# Altium schematic sheet adc_chanels.b.SchDoc
size A4
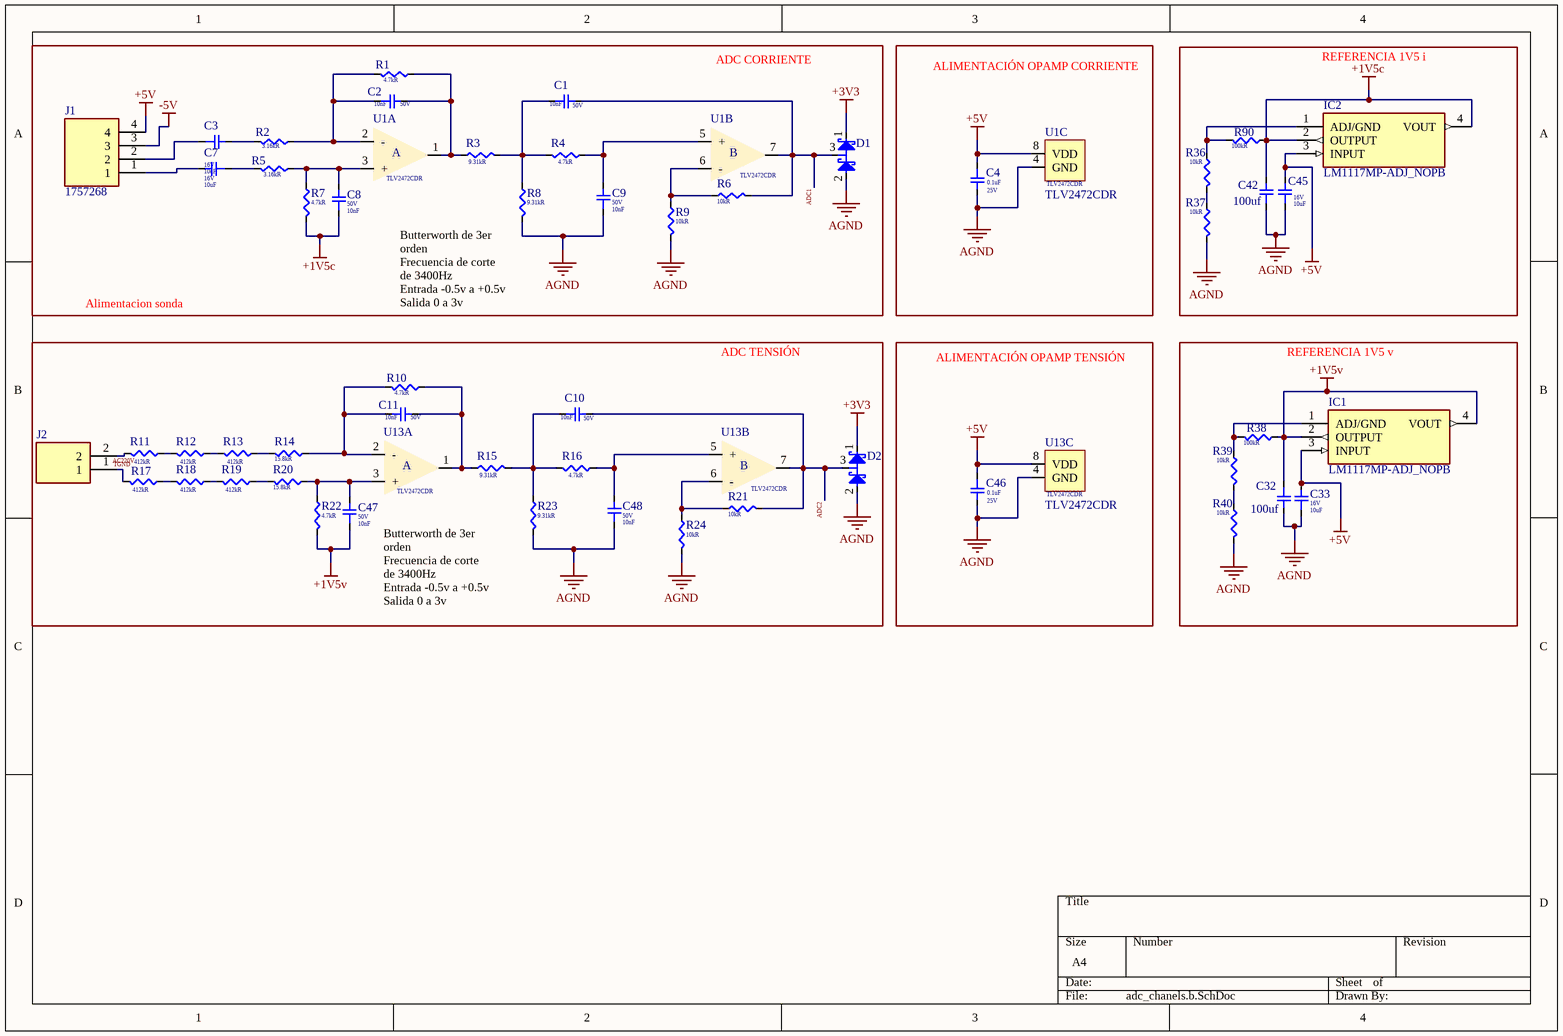
[diagram p0: adc_chanels.b.SchDoc]

## Parts
C1  Voltage: 50V  Capacitance: 10nF  [CAP smd 0805 ok]  (hidden comment: CAP_GRM2195C1H103FA01D_MURATA)
C2  Voltage: 50V  Capacitance: 10nF  [CAP smd 0805 ok]  (hidden comment: CAP_GRM2195C1H103FA01D_MURATA)
C3  Voltage Rating: 16V  Capacitance: 10uF  [CAP smd 0805 OK]  (hidden comment: CAP_CL21A106KOCL3RC)
C4  Voltage Rating: 25V  Capacitance: 0.1uF  [CAP smd 0805 ok]  (hidden comment: CAP_CC0805KRX7R8BB104_YAGEO)
C7  Voltage Rating: 16V  Capacitance: 10uF  [CAP smd 0805 OK]  (hidden comment: CAP_CL21A106KOCL3RC)
C8  Voltage: 50V  Capacitance: 10nF  [CAP smd 0805 ok]  (hidden comment: CAP_GRM2195C1H103FA01D_MURATA)
C9  Voltage: 50V  Capacitance: 10nF  [CAP smd 0805 ok]  (hidden comment: CAP_GRM2195C1H103FA01D_MURATA)
C10  Voltage: 50V  Capacitance: 10nF  [CAP smd 0805 ok]  (hidden comment: CAP_GRM2195C1H103FA01D_MURATA)
C11  Voltage: 50V  Capacitance: 10nF  [CAP smd 0805 ok]  (hidden comment: CAP_GRM2195C1H103FA01D_MURATA)
C32  100uf  [Cap 100uf]
C33  Voltage Rating: 16V  Capacitance: 10uF  [CAP smd 0805 OK]  (hidden comment: CAP_CL21A106KOCL3RC)
C42  100uf  [Cap 100uf]
C45  Voltage Rating: 16V  Capacitance: 10uF  [CAP smd 0805 OK]  (hidden comment: CAP_CL21A106KOCL3RC)
C46  Voltage Rating: 25V  Capacitance: 0.1uF  [CAP smd 0805 ok]  (hidden comment: CAP_CC0805KRX7R8BB104_YAGEO)
C47  Voltage: 50V  Capacitance: 10nF  [CAP smd 0805 ok]  (hidden comment: CAP_GRM2195C1H103FA01D_MURATA)
C48  Voltage: 50V  Capacitance: 10nF  [CAP smd 0805 ok]  (hidden comment: CAP_GRM2195C1H103FA01D_MURATA)
D1  BAS40-04-TP  [diode shockit ok]  (value not drawn)
D2  BAS40-04-TP  [diode shockit ok]  (value not drawn)
IC1  LM1117MP-ADJ_NOPB  [SOT230P700X180-4N]
IC2  LM1117MP-ADJ_NOPB  [SOT230P700X180-4N]
J1  1757268  [1757268]
J2  1757242  [1757242]  (value not drawn)
R1  Resistance: 4.7kR  [res 0805 ok]  (hidden comment: RC0805FR-074K7L)
R2  Resistance: 3.16kR  [res 0805 ok]  (hidden comment: RC0805FR-073K16L)
R3  Resistance: 9.31kR  [res 0805 ok]  (hidden comment: RC0805FR-079K31L)
R4  Resistance: 4.7kR  [res 0805 ok]  (hidden comment: RC0805FR-074K7L)
R5  Resistance: 3.16kR  [res 0805 ok]  (hidden comment: RC0805FR-073K16L)
R6  Resistance: 10kR  [res 0805 ok]  (hidden comment: RC0805FR-0710KL)
R7  Resistance: 4.7kR  [res 0805 ok]  (hidden comment: RC0805FR-074K7L)
R8  Resistance: 9.31kR  [res 0805 ok]  (hidden comment: RC0805FR-079K31L)
R9  Resistance: 10kR  [res 0805 ok]  (hidden comment: RC0805FR-0710KL)
R10  Resistance: 4.7kR  [res 0805 ok]  (hidden comment: RC0805FR-074K7L)
R11  Resistance: 412kR  [res 0805 ok]  (hidden comment: RC0805FR-07412KL)
R12  Resistance: 412kR  [res 0805 ok]  (hidden comment: RC0805FR-07412KL)
R13  Resistance: 412kR  [res 0805 ok]  (hidden comment: RC0805FR-07412KL)
R14  Resistance: 15.8kR  [res 0805 ok]  (hidden comment: RC0805FR-0715K8L)
R15  Resistance: 9.31kR  [res 0805 ok]  (hidden comment: RC0805FR-079K31L)
R16  Resistance: 4.7kR  [res 0805 ok]  (hidden comment: RC0805FR-074K7L)
R17  Resistance: 412kR  [res 0805 ok]  (hidden comment: RC0805FR-07412KL)
R18  Resistance: 412kR  [res 0805 ok]  (hidden comment: RC0805FR-07412KL)
R19  Resistance: 412kR  [res 0805 ok]  (hidden comment: RC0805FR-07412KL)
R20  Resistance: 15.8kR  [res 0805 ok]  (hidden comment: RC0805FR-0715K8L)
R21  Resistance: 10kR  [res 0805 ok]  (hidden comment: RC0805FR-0710KL)
R22  Resistance: 4.7kR  [res 0805 ok]  (hidden comment: RC0805FR-074K7L)
R23  Resistance: 9.31kR  [res 0805 ok]  (hidden comment: RC0805FR-079K31L)
R24  Resistance: 10kR  [res 0805 ok]  (hidden comment: RC0805FR-0710KL)
R36  Resistance: 10kR  [res 0805 ok]  (hidden comment: RC0805JR-0710KL)
R37  Resistance: 10kR  [res 0805 ok]  (hidden comment: RC0805JR-0710KL)
R38  Resistance: 100kR  [res 0805 ok]  (hidden comment: AC0805JR-07100KL)
R39  Resistance: 10kR  [res 0805 ok]  (hidden comment: RC0805JR-0710KL)
R40  Resistance: 10kR  [res 0805 ok]  (hidden comment: RC0805JR-0710KL)
R90  Resistance: 100kR  [res 0805 ok]  (hidden comment: AC0805JR-07100KL)
U1  TLV2472CDR  [tlv2472 ok]  (value not drawn)  (parts A,B,C of 3)
U13  TLV2472CDR  [tlv2472 ok]  (value not drawn)  (parts A,B,C of 3)

## Blocks framed on the sheet
ALIMENTACIÓN OPAMP CORRIENTE: C4 U1
REFERENCIA 1V5 i: C42 C45 IC2 R36 R37 R90
ADC TENSIÓN: C10 C11 C47 C48 D2 J2 R10-R24 U13
ALIMENTACIÓN OPAMP TENSIÓN: C46 U13
REFERENCIA 1V5 v: C32 C33 IC1 R38-R40

## Nets
+1V5c: C8.23 C42.23 IC2.2(OUTPUT) IC2.4(VOUT) R7.2 R90.1
+1V5v: C32.22 C47.23 IC1.2(OUTPUT) IC1.4(VOUT) R22.2 R38.1
+3V3: D1.1 D2.1
+5V: C4.23 C33.22 C45.22 C46.23 IC1.3(INPUT) IC2.3(INPUT) J1.4 U1.8(VDD) U13.8(VDD)
-5V: J1.3
AGND: C4.22 C9.23 C32.23 C33.23 C42.22 C45.23 C46.22 C48.23 D1.2 D2.2 R8.2 R9.2 R23.2 R24.2 R37.1 R40.1 U1.4(GND) U13.4(GND)
AC220V: J2.2 R11.2
ADC1: C1.22 D1.3 R6.2 U1.7
ADC2: C10.22 D2.3 R21.2 U13.7
TGND: J2.1 R17.2
NetC1_23: C1.23 R3.2 R4.2 R8.1
NetC2_22: C2.22 R1.1 R3.1 U1.1
NetC2_23: C2.23 R1.2 R2.2 U1.2(-)
NetC3_22: C3.22 R2.1
NetC3_23: C3.23 J1.2
NetC7_22: C7.22 J1.1
NetC7_23: C7.23 R5.1
NetC8_22: C8.22 R5.2 R7.1 U1.3(+)
NetC9_22: C9.22 R4.1 U1.5(+)
NetC10_23: C10.23 R15.2 R16.2 R23.1
NetC11_22: C11.22 R10.1 R15.1 U13.1
NetC11_23: C11.23 R10.2 R14.1 U13.2(-)
NetC47_22: C47.22 R20.1 R22.1 U13.3(+)
NetC48_22: C48.22 R16.1 U13.5(+)
NetIC1_1: IC1.1(ADJ/GND) R38.2 R39.2
NetIC2_1: IC2.1(ADJ/GND) R36.2 R90.2
NetR6_1: R6.1 R9.1 U1.6(-)
NetR11_1: R11.1 R12.2
NetR12_1: R12.1 R13.2
NetR13_1: R13.1 R14.2
NetR17_1: R17.1 R18.2
NetR18_1: R18.1 R19.2
NetR19_1: R19.1 R20.2
NetR21_1: R21.1 R24.1 U13.6(-)
NetR36_1: R36.1 R37.2
NetR39_1: R39.1 R40.2

## Notes on the sheet
- ADC CORRIENTE
- Alimentacion sonda
- (near R8) Butterworth de 3er orden
  Frecuencia de corte de 3400Hz
  Entrada -0.5v a +0.5v
  Salida 0 a 3v
- Butterworth de 3er orden
  Frecuencia de corte de 3400Hz
  Entrada -0.5v a +0.5v
  Salida 0 a 3v
- (in symbol TLV2472CDR, part A) A
- (in symbol TLV2472CDR, part B) B

## Library data of the parts
C1 C2 C8-C11 C47 C48 = CAP_GRM2195C1H103FA01D_MURATA: 0805 10 nF 50 V ±1% Tolerance C0G SMD Multilayer Ceramic Capacitor; Manufacturer 1: Murata; Temperature Coefficient: 30ppm/°C; Supplier 1: Arrow Electronics; Manufacturer Part Number 1: GRM2195C1H103FA01D; Stock 1: 3; Pricing 1: 1=0,54310 (USD); RoHS: Yes; Mount: Surface Mount; Case/Package: 0805; Case Code (Imperial): 0805; Case Code (Metric): 2012; Min Operating Temperature: -55°C; Max Operating Temperature: 125°C; Tolerance: 1%; Dielectric: C0G; Packaging: Tape and Reel; Voltage Rating: 50V; Voltage Rating (DC): 50V; Package Quantity: 4000; Termination: SMD/SMT; Series: GRM; Construction: Flat; Length: 2mm; Width: 1.25mm; Height: 0.85mm; Depth: 1.25mm; Thickness: 0.037inch; Radiation Hardening: No; REACH SVHC: No SVHC; Lead Free: Lead Free; RoHS Compliant: Yes; ComponentLink1URL: https://datasheet.ciiva.com/29542/partnumbering-e-01-29542571.pdf?src-supplier=Digi-Key; ComponentLink1Description: https://datasheet.ciiva.com/29542/partnumbering-e-01-29542571.pdf?src-supplier=Digi-Key; ComponentLink2URL: https://datasheet.ciiva.com/29542/partnumbering-e-01-29542569.pdf?src-supplier=Digi-Key; ComponentLink2Description: https://datasheet.ciiva.com/29542/partnumbering-e-01-29542569.pdf?src-supplier=Digi-Key; ComponentLink3URL: https://datasheet.ciiva.com/29542/partnumbering-e-01-29542570.pdf?src-supplier=Digi-Key; ComponentLink3Description: https://datasheet.ciiva.com/29542/partnumbering-e-01-29542570.pdf?src-supplier=Digi-Key; ComponentLink4URL: https://datasheet.ciiva.com/17452/c02e-17452856.pdf?src-supplier=Avnet+Europe; ComponentLink4Description: https://datasheet.ciiva.com/17452/c02e-17452856.pdf?src-supplier=Avnet+Europe; ComponentLink5URL: https://datasheet.ciiva.com/16497/c02e-16497047.pdf?src-supplier=Future+Electronics; ComponentLink5Description: https://datasheet.ciiva.com/16497/c02e-16497047.pdf?src-supplier=Future+Electronics; Supplier Part Number 1: GRM2195C1H103FA01D
C3 C7 C33 C45 = CAP_CL21A106KOCL3RC: CAP CER 10UF 16V X5R 0805; Manufacturer 1: Samsung; Tolerance: 10%; Supplier 1: Digi-Key; Manufacturer Part Number 1: CL21A106KOCL3RC; Stock 1: 0; RoHS: Yes; Mount: Surface Mount; Case/Package: 0805; Case Code (Metric): 2012; Case Code (Imperial): 0805; Min Operating Temperature: -55°C; Max Operating Temperature: 85°C; Package Quantity: 1; Packaging: Tape and Reel; Series: CL; Length: 0.079inch; Width: 0.049inch; Thickness: 0.037inch; RoHS Compliant: Yes; ComponentLink1URL: https://datasheet.ciiva.com/25796/cl21a106kocl3rc-25796224.pdf?src-supplier=Digi-Key; ComponentLink1Description: https://datasheet.ciiva.com/25796/cl21a106kocl3rc-25796224.pdf?src-supplier=Digi-Key; Supplier Part Number 1: 1276-2398-2-ND
C4 C46 = CAP_CC0805KRX7R8BB104_YAGEO: CAPACITOR, 0805, 100NF, 25V, REEL 4000; Manufacturer 1: Yageo; Material: Ceramic; Tolerance: 10%; Dielectric: X7R; Insulation Resistance: 100GR; Supplier 1: Digi-Key; Manufacturer Part Number 1: CC0805KRX7R8BB104; Stock 1: 278639; Pricing 1: 1=0,12000, 10=0,08800, 50=0,04980, 100=0,04130, 500=0,02894, 1000=0,02396 (USD); RoHS: Yes; Mount: Surface Mount; Case/Package: 0805; Number of Pins: 2; Case Code (Metric): 2012; Case Code (Imperial): 0805; Min Operating Temperature: -55°C; Max Operating Temperature: 125°C; Package Quantity: 1; Packaging: Tape and Reel; Voltage Rating (DC): 25V; Termination: SMD/SMT; Resistor Type: Ceramic; Series: CC; Length: 2mm; Width: 0.049inch; Height: 0.85mm; Thickness: 0.033inch; Depth: 1.25mm; Radiation Hardening: No; REACH SVHC: No SVHC; Lead Free: Lead Free; Halogen Free: Halogen Free; RoHS Compliant: Yes; ComponentLink1URL: https://datasheet.ciiva.com/8034/70765-8034031.pdf?src-supplier=Element14; ComponentLink1Description: https://datasheet.ciiva.com/8034/70765-8034031.pdf?src-supplier=Element14; ComponentLink2URL: https://datasheet.ciiva.com/28450/1489800-28450789.pdf?src-supplier=Element14; ComponentLink2Description: https://datasheet.ciiva.com/28450/1489800-28450789.pdf?src-supplier=Element14; ComponentLink3URL: https://datasheet.ciiva.com/46430/1850775-46430166.pdf?src-supplier=Element14; ComponentLink3Description: https://datasheet.ciiva.com/46430/1850775-46430166.pdf?src-supplier=Element14; ComponentLink4URL: https://datasheet.ciiva.com/145/mlccorderingcode-145008.pdf?src-supplier=Digi-Key; ComponentLink4Description: https://datasheet.ciiva.com/145/mlccorderingcode-145008.pdf?src-supplier=Digi-Key; ComponentLink5URL: https://datasheet.ciiva.com/145/mlccorderingcode-145007.pdf?src-supplier=Digi-Key; ComponentLink5Description: https://datasheet.ciiva.com/145/mlccorderingcode-145007.pdf?src-supplier=Digi-Key; ComponentLink6URL: https://datasheet.ciiva.com/145/mlccorderingcode-145009.pdf?src-supplier=Digi-Key; ComponentLink6Description: https://datasheet.ciiva.com/145/mlccorderingcode-145009.pdf?src-supplier=Digi-Key; ComponentLink7URL: https://datasheet.ciiva.com/8034/1784427-8034030.pdf?src-supplier=Element14; ComponentLink7Description: https://datasheet.ciiva.com/8034/1784427-8034030.pdf?src-supplier=Element14; ComponentLink8URL: https://datasheet.ciiva.com/8034/1784427-8034029.pdf?src-supplier=Element14; ComponentLink8Description: https://datasheet.ciiva.com/8034/1784427-8034029.pdf?src-supplier=Element14; ComponentLink9URL: https://datasheet.ciiva.com/15189/getdatasheetpartid-330244-15189223.pdf?src-supplier=Verical; ComponentLink9Description: https://datasheet.ciiva.com/15189/getdatasheetpartid-330244-15189223.pdf?src-supplier=Verical; ComponentLink10URL: https://datasheet.ciiva.com/16625/upy-gphc-x7r-6-3v-to-50v-8-16625546.pdf?src-supplier=Avnet+Europe; ComponentLink10Description: https://datasheet.ciiva.com/16625/upy-gphc-x7r-6-3v-to-50v-8-16625546.pdf?src-supplier=Avnet+Europe; Supplier Part Number 1: 311-1141-1-ND
C32 C42 = CAP 100uf murata
D1 D2 = BAS40-04-TP: DIODE ARRAY SCHOTTKY 40V SOT23; Manufacturer 1: MCC; Max Surge Current: 600mA; Recovery Time: 5ns; Forward Current: 200mA; Forward Voltage: 1V; Max Reverse Leakage Current: 200nA; Power Dissipation: 200mW; Element Configuration: Single; Capacitance: 5pF; Supplier 1: Digi-Key; Manufacturer Part Number 1: BAS40-04-TP; Stock 1: 0; Pricing 1: 1=0,26000, 10=0,21300, 100=0,11290, 500=0,07424, 1000=0,05049 (USD); RoHS: Yes; Mount: Surface Mount; Case/Package: SOT-23; Number of Pins: 3; Min Operating Temperature: -55°C; Max Operating Temperature: 125°C; Package Quantity: 3000; Packaging: Tape and Reel; Average Rectified Current: 200mA; Reverse Recovery Time: 5ns; Max Forward Surge Current (Ifsm): 600mA; Max Reverse Current: 200nA; Max Repetitive Reverse Voltage (Vrrm): 40V; Peak Non-Repetitive Surge Current: 600mA; Max Reverse Voltage (DC): 40V; Series: -; Length: 3.04mm; Width: 1.4mm; Height: 1.02mm; Radiation Hardening: No; REACH SVHC: Unknown; Lead Free: Lead Free; RoHS Compliant: Yes; ComponentLink1URL: https://datasheet.ciiva.com/4716/bas40-bas70sot-23-28891-4716000.pdf?src-supplier=Mouser; ComponentLink1Description: https://datasheet.ciiva.com/4716/bas40-bas70sot-23-28891-4716000.pdf?src-supplier=Mouser; ComponentLink2URL: https://datasheet.ciiva.com/23684/1684803-23684306.pdf?src-supplier=Newark; ComponentLink2Description: https://datasheet.ciiva.com/23684/1684803-23684306.pdf?src-supplier=Newark; ComponentLink3URL: https://datasheet.ciiva.com/906/bas40-bas70sot-23-906318.pdf?src-supplier=Digi-Key; ComponentLink3Description: https://datasheet.ciiva.com/906/bas40-bas70sot-23-906318.pdf?src-supplier=Digi-Key; ComponentLink4URL: https://datasheet.ciiva.com/906/bas40-bas70sot-23-906319.pdf?src-supplier=Digi-Key; ComponentLink4Description: https://datasheet.ciiva.com/906/bas40-bas70sot-23-906319.pdf?src-supplier=Digi-Key; ComponentLink5URL: https://datasheet.ciiva.com/906/bas40-bas70sot-23-906320.pdf?src-supplier=Digi-Key; ComponentLink5Description: https://datasheet.ciiva.com/906/bas40-bas70sot-23-906320.pdf?src-supplier=Digi-Key; ComponentLink6URL: https://datasheet.ciiva.com/7624/1684803-7624699.pdf?src-supplier=Element14; ComponentLink6Description: https://datasheet.ciiva.com/7624/1684803-7624699.pdf?src-supplier=Element14; ComponentLink7URL: https://datasheet.ciiva.com/15200/getdatasheetpartid-226544-15200426.pdf?src-supplier=Verical; ComponentLink7Description: https://datasheet.ciiva.com/15200/getdatasheetpartid-226544-15200426.pdf?src-supplier=Verical; Supplier Part Number 1: BAS40-04TPMSDKR-ND
IC1 IC2 = LM1117MP-ADJ_NOPB: Integrated Circuit; Manufacturer_Name: Texas Instruments; Manufacturer_Part_Number: LM1117MP-ADJ/NOPB; Datasheet Link: https://datasheet.datasheetarchive.com/originals/distributors/Datasheets-SFU2/DSASFU100036103.pdf; Height: 1.8mm; Mouser Part Number: 926-LM1117MP-ADJNOPB; Mouser Price/Stock: https://www.mouser.co.uk/ProductDetail/Texas-Instruments/LM1117MP-ADJ-NOPB?qs=X1J7HmVL2ZHIFGWbJS5wtA%3D%3D; Arrow Part Number: LM1117MP-ADJ/NOPB; Arrow Price/Stock: https://www.arrow.com/en/products/lm1117mp-adjnopb/texas-instruments
J1 = 1757268: Connector; Manufacturer_Name: Phoenix Contact; Datasheet Link: http://www.phoenixcontact.com/de/produkte/1757268/pdf; Height: 8.72mm; Manufacturer_Part_Number: 1757268; Mouser Part Number: 651-1757268; Mouser Price/Stock: https://www.mouser.co.uk/ProductDetail/Phoenix-Contact/1757268?qs=uD%2FdkN7XIa2BicmSj3mD7g%3D%3D; Arrow Part Number: 1757268; Arrow Price/Stock: https://www.arrow.com/en/products/1757268/phoenix-contact?region=nac
J2 = 1757242: Connector; Manufacturer_Name: Phoenix Contact; Datasheet Link: http://www.phoenixcontact.com/de/produkte/1757242/pdf; Height: 8.72mm; Manufacturer_Part_Number: 1757242; Mouser Part Number: 651-1757242; Mouser Price/Stock: https://www.mouser.co.uk/ProductDetail/Phoenix-Contact/1757242?qs=uD%2FdkN7XIa3Ejiz9qDxlzw%3D%3D; Arrow Part Number: 1757242; Arrow Price/Stock: https://www.arrow.com/en/products/1757242/phoenix-contact?region=nac
R1 R4 R7 R10 R16 R22 = RC0805FR-074K7L: YAGEO - RC0805FR-074K7L - SMD  0805 [2012 Metric], 4.7 kohm,  125 mW; Tolerance: 1%; Temperature Coefficient: 100ppm/°C; Voltage Rating (DC): 150V; Power Rating: 125mW; Supplier 1: RSComponents; Manufacturer 1: Yageo; Manufacturer Part Number 1: RC0805FR-074K7L; Stock 1: 55000; Pricing 1: 5000=0,00500 (GBP); RoHS: Yes; Case/Package: 0805; Number of Pins: 2; Case Code (Metric): 2012; Case Code (Imperial): 0805; Size Code: 0805; Min Operating Temperature: -55°C; Max Operating Temperature: 155°C; Resistor Type: Thick Film; Packaging: Tape and Reel; Package Quantity: 5000; Voltage Rating: 150V; Number of Terminations: 2; Termination: SMD/SMT; Max Power Dissipation: 125mW; Features: Moisture Resistant; Series: RC; Resistance Tolerance: 1%; Technology: THICK FILM; Construction: Rectangular; Length: 0.079inch; Width: 0.049inch; Height: 0.024inch; Depth: 1.25mm; REACH SVHC: No SVHC; Lead Free: Lead Free; RoHS Compliant: Yes; Military Standard: Not; ComponentLink1URL: https://datasheet.ciiva.com/11808/0900766b8106beab-11808155.pdf?src-supplier=RSComponents; ComponentLink1Description: https://datasheet.ciiva.com/11808/0900766b8106beab-11808155.pdf?src-supplier=RSComponents; ComponentLink2URL: https://datasheet.ciiva.com/6547/pyu-r-int-thick-7-6547263.pdf?src-supplier=Digi-Key; ComponentLink2Description: https://datasheet.ciiva.com/6547/pyu-r-int-thick-7-6547263.pdf?src-supplier=Digi-Key; ComponentLink3URL: https://datasheet.ciiva.com/7941/444164-7941806.pdf?src-supplier=Element14; ComponentLink3Description: https://datasheet.ciiva.com/7941/444164-7941806.pdf?src-supplier=Element14; ComponentLink4URL: https://datasheet.ciiva.com/46447/444164-46447583.pdf?src-supplier=Element14; ComponentLink4Description: https://datasheet.ciiva.com/46447/444164-46447583.pdf?src-supplier=Element14; ComponentLink5URL: https://datasheet.ciiva.com/7941/444164-7941804.pdf?src-supplier=Element14; ComponentLink5Description: https://datasheet.ciiva.com/7941/444164-7941804.pdf?src-supplier=Element14; ComponentLink6URL: https://datasheet.ciiva.com/7941/1686128-7941805.pdf?src-supplier=Element14; ComponentLink6Description: https://datasheet.ciiva.com/7941/1686128-7941805.pdf?src-supplier=Element14; Supplier Part Number 1: 6181408
R2 R5 = RC0805FR-073K16L: Res Thick Film smd 0805 3.16K Ohm 1% 0.125W(1/8W); Manufacturer 1: Yageo; Power Rating: 125mW; Voltage Rating: 150V; Temperature Coefficient: 100ppm/°C; Supplier 1: Digi-Key; Manufacturer Part Number 1: RC0805FR-073K16L; Stock 1: 24399; Pricing 1: 1=0,10000, 10=0,04200, 100=0,01690, 1000=0,00759, 2500=0,00659 (USD); RoHS: Yes; Case/Package: 0805; Case Code (Metric): 2012; Case Code (Imperial): 0805; Weight: 0.000194oz; Size Code: 0805; Min Operating Temperature: -55°C; Max Operating Temperature: 155°C; Tolerance: 1%; Package Quantity: 1; Packaging: Tape and Reel; Resistor Type: Thick Film; Number of Terminations: 2; Termination: SMD/SMT; Max Power Dissipation: 125mW; Voltage Rating (DC): 150V; Features: Moisture Resistant; Series: RC; Construction: Rectangular; Length: 2mm; Width: 0.049inch; Height: 0.024inch; Depth: 1.25mm; Military Standard: Not; Lead Free: Lead Free; RoHS Compliant: Yes; ComponentLink1URL: https://datasheet.ciiva.com/2457/pyu-r-int-thick-7-2457284.pdf?src-supplier=Digi-Key; ComponentLink1Description: https://datasheet.ciiva.com/2457/pyu-r-int-thick-7-2457284.pdf?src-supplier=Digi-Key; ComponentLink2URL: https://datasheet.ciiva.com/2457/pyu-r-int-thick-7-2457285.pdf?src-supplier=Digi-Key; ComponentLink2Description: https://datasheet.ciiva.com/2457/pyu-r-int-thick-7-2457285.pdf?src-supplier=Digi-Key; ComponentLink3URL: https://datasheet.ciiva.com/2457/pyu-r-int-thick-7-2457286.pdf?src-supplier=Digi-Key; ComponentLink3Description: https://datasheet.ciiva.com/2457/pyu-r-int-thick-7-2457286.pdf?src-supplier=Digi-Key; ComponentLink4URL: https://datasheet.ciiva.com/12577/rc0805-12577436.pdf?src-supplier=Mouser; ComponentLink4Description: https://datasheet.ciiva.com/12577/rc0805-12577436.pdf?src-supplier=Mouser; Supplier Part Number 1: 311-3.16KCRCT-ND
R3 R8 R15 R23 = RC0805FR-079K31L: Res Thick Film smd 0805 9.31K Ohm 1% 0.125W(1/8W); Manufacturer 1: Yageo; Temperature Coefficient: 100ppm/°C; Power Rating: 125mW; Voltage Rating: 150V; Supplier 1: Digi-Key; Manufacturer Part Number 1: RC0805FR-079K31L; Stock 1: 10181; Pricing 1: 1=0,10000, 10=0,04200, 100=0,01690, 1000=0,00759, 2500=0,00659 (USD); RoHS: Yes; Case/Package: 0805; Contact Plating: Tin,Lead,Matte; Case Code (Imperial): 0805; Case Code (Metric): 2012; Size Code: 0805; Min Operating Temperature: -55°C; Max Operating Temperature: 155°C; Tolerance: 1%; Resistor Type: Thick Film; Packaging: Tape and Reel; Package Quantity: 1; Termination: SMD/SMT; Number of Terminations: 2; Max Power Dissipation: 125mW; Voltage Rating (DC): 150V; Features: Moisture Resistant; Series: RC; Construction: Rectangular; Length: 2mm; Width: 1.25mm; Height: 0.024inch; Depth: 1.25mm; Radiation Hardening: No; Military Standard: Not; Lead Free: Lead Free; RoHS Compliant: Yes; ComponentLink1URL: https://datasheet.ciiva.com/2457/pyu-r-int-thick-7-2457635.pdf?src-supplier=Digi-Key; ComponentLink1Description: https://datasheet.ciiva.com/2457/pyu-r-int-thick-7-2457635.pdf?src-supplier=Digi-Key; ComponentLink2URL: https://datasheet.ciiva.com/2457/pyu-r-int-thick-7-2457636.pdf?src-supplier=Digi-Key; ComponentLink2Description: https://datasheet.ciiva.com/2457/pyu-r-int-thick-7-2457636.pdf?src-supplier=Digi-Key; ComponentLink3URL: https://datasheet.ciiva.com/2457/pyu-r-int-thick-7-2457637.pdf?src-supplier=Digi-Key; ComponentLink3Description: https://datasheet.ciiva.com/2457/pyu-r-int-thick-7-2457637.pdf?src-supplier=Digi-Key; ComponentLink4URL: https://datasheet.ciiva.com/17074/rc0805-17074679.pdf?src-supplier=Future+Electronics; ComponentLink4Description: https://datasheet.ciiva.com/17074/rc0805-17074679.pdf?src-supplier=Future+Electronics; Supplier Part Number 1: 311-9.31KCRCT-ND
R6 R9 R21 R24 = RC0805FR-0710KL: RES SMD  0805 10K OHM 1% 1/8W; Manufacturer 1: Yageo; Temperature Coefficient: 100ppm/°C; Power Rating: 125mW; Voltage Rating: 150V; Supplier 1: Digi-Key; Manufacturer Part Number 1: RC0805FR-0710KL; Stock 1: 7813114; Pricing 1: 1=0,10000, 10=0,04200, 100=0,01690, 1000=0,00759, 2500=0,00659 (USD); RoHS: Yes; Case/Package: 0805; Case Code (Imperial): 0805; Case Code (Metric): 2012; Size Code: 0805; Min Operating Temperature: -55°C; Max Operating Temperature: 155°C; Tolerance: 1%; Resistor Type: Thick Film; Packaging: Tape and Reel; Package Quantity: 1; Termination: SMD/SMT; Number of Terminations: 2; Max Power Dissipation: 125mW; Features: Moisture Resistant; Series: RC; Construction: Rectangular; Resistance Tolerance: 1%; Technology: THICK FILM; Length: 2mm; Width: 0.049inch; Height: 0.024inch; Depth: 1.25mm; REACH SVHC: Unknown; Military Standard: Not; Lead Free: Lead Free; RoHS Compliant: Yes; ComponentLink1URL: https://datasheet.ciiva.com/11808/0900766b8106beab-11808151.pdf?src-supplier=RSComponents; ComponentLink1Description: https://datasheet.ciiva.com/11808/0900766b8106beab-11808151.pdf?src-supplier=RSComponents; ComponentLink2URL: https://datasheet.ciiva.com/12669/rc0805-12669688.pdf?src-supplier=Mouser; ComponentLink2Description: https://datasheet.ciiva.com/12669/rc0805-12669688.pdf?src-supplier=Mouser; ComponentLink3URL: https://datasheet.ciiva.com/2456/pyu-r-int-thick-7-2456974.pdf?src-supplier=Digi-Key; ComponentLink3Description: https://datasheet.ciiva.com/2456/pyu-r-int-thick-7-2456974.pdf?src-supplier=Digi-Key; ComponentLink4URL: https://datasheet.ciiva.com/2456/pyu-r-int-thick-7-2456972.pdf?src-supplier=Digi-Key; ComponentLink4Description: https://datasheet.ciiva.com/2456/pyu-r-int-thick-7-2456972.pdf?src-supplier=Digi-Key; ComponentLink5URL: https://datasheet.ciiva.com/2456/pyu-r-int-thick-7-2456973.pdf?src-supplier=Digi-Key; ComponentLink5Description: https://datasheet.ciiva.com/2456/pyu-r-int-thick-7-2456973.pdf?src-supplier=Digi-Key; ComponentLink6URL: https://datasheet.ciiva.com/16747/rc0805-16747087.pdf?src-supplier=Future+Electronics; ComponentLink6Description: https://datasheet.ciiva.com/16747/rc0805-16747087.pdf?src-supplier=Future+Electronics; ComponentLink7URL: https://datasheet.ciiva.com/46447/444164-46447563.pdf?src-supplier=Element14; ComponentLink7Description: https://datasheet.ciiva.com/46447/444164-46447563.pdf?src-supplier=Element14; Supplier Part Number 1: 311-10.0KCRCT-ND
R11-R13 R17-R19 = RC0805FR-07412KL: RES SMD 0805 412K OHM 1% 1/8W; Manufacturer 1: Yageo; Power Rating: 125mW; Voltage Rating: 150V; Temperature Coefficient: 100ppm/°C; Supplier 1: Digi-Key; Manufacturer Part Number 1: RC0805FR-07412KL; Stock 1: 1412; Pricing 1: 1=0,10000, 10=0,04200, 100=0,01690, 1000=0,00759, 2500=0,00659 (USD); RoHS: Yes; Case/Package: 0805; Case Code (Imperial): 0805; Case Code (Metric): 2012; Min Operating Temperature: -55°C; Max Operating Temperature: 155°C; Packaging: Tape and Reel; Tolerance: 1%; Termination: SMD/SMT; Resistor Type: Thick Film; Voltage Rating (DC): 150V; Working Voltage: 150V; Number of Terminations: 2; Features: Moisture Resistant; Series: RC; Max Power Dissipation: 125mW; Technology: THICK FILM; Construction: Rectangular; Length: 2mm; Width: 1.25mm; Height: 0.5mm; Depth: 1.25mm; Military Standard: Not; Lead Free: Lead Free; RoHS Compliant: Yes; ComponentLink1URL: http://www.mouser.com/ds/2/447/Yageo_08112016_RC0805-968729.pdf?src-supplier=Mouser; ComponentLink1Description: http://www.mouser.com/ds/2/447/Yageo_08112016_RC0805-968729.pdf?src-supplier=Mouser; ComponentLink2URL: http://components.arrow.com/part/dataview/0323_03542655?src-supplier=Arrow+Europe; ComponentLink2Description: http://components.arrow.com/part/dataview/0323_03542655?src-supplier=Arrow+Europe; ComponentLink3URL: http://www.yageo.com/documents/recent/PYu-RC_Group_51_RoHS_L_9.pdf?src-supplier=Digi-Key; ComponentLink3Description: http://www.yageo.com/documents/recent/PYu-RC_Group_51_RoHS_L_9.pdf?src-supplier=Digi-Key; ComponentLink4URL: http://www.yageo.com/documents/recent/PYu-RC_Group_51_RoHS_L_10.pdf?src-supplier=Digi-Key; ComponentLink4Description: http://www.yageo.com/documents/recent/PYu-RC_Group_51_RoHS_L_10.pdf?src-supplier=Digi-Key; ComponentLink5URL: http://www.yageo.com/documents/recent/PYu-RC0805_51_RoHS_L_v5.pdf?src-supplier=Future+Electronics; ComponentLink5Description: http://www.yageo.com/documents/recent/PYu-RC0805_51_RoHS_L_v5.pdf?src-supplier=Future+Electronics; Supplier Part Number 1: 311-412KCRCT-ND
R14 R20 = RC0805FR-0715K8L: Res Thick Film smd 0805 15.8K Ohm 1% 0.125W(1/8W); Manufacturer 1: Yageo; Temperature Coefficient: 100ppm/°C; Power Rating: 125mW; Voltage Rating: 150V; Supplier 1: Digi-Key; Manufacturer Part Number 1: RC0805FR-0715K8L; Stock 1: 65412; Pricing 1: 1=0,10000, 10=0,04200, 100=0,01690, 1000=0,00759, 2500=0,00659 (USD); RoHS: Yes; Case/Package: 0805; Contact Plating: Tin,Matte,Lead; Case Code (Imperial): 0805; Case Code (Metric): 2012; Size Code: 0805; Min Operating Temperature: -55°C; Max Operating Temperature: 155°C; Tolerance: 1%; Resistor Type: Thick Film; Packaging: Tape and Reel; Termination: SMD/SMT; Voltage Rating (DC): 150V; Features: Moisture Resistant; Series: RC; Max Power Dissipation: 125mW; Number of Terminations: 2; Construction: Rectangular; Length: 2mm; Depth: 1.25mm; Radiation Hardening: No; Military Standard: Not; Lead Free: Lead Free; RoHS Compliant: Yes; ComponentLink1URL: https://datasheet.ciiva.com/5558/rc0805-5558198.pdf?src-supplier=Mouser; ComponentLink1Description: https://datasheet.ciiva.com/5558/rc0805-5558198.pdf?src-supplier=Mouser; ComponentLink2URL: https://datasheet.ciiva.com/17054/rc0805-17054650.pdf?src-supplier=Future+Electronics; ComponentLink2Description: https://datasheet.ciiva.com/17054/rc0805-17054650.pdf?src-supplier=Future+Electronics; Supplier Part Number 1: 311-15.8KCRCT-ND
R36 R37 R39 R40 = RC0805JR-0710KL: Res Thick Film smd 0805 10K Ohm 5% 1/8W; Manufacturer 1: Yageo; Power Rating: 125mW; Temperature Coefficient: 100ppm/°C; Voltage Rating: 150V; Supplier 1: Digi-Key; Manufacturer Part Number 1: RC0805JR-0710KL; Stock 1: 2124400; Pricing 1: 1=0,10000, 10=0,03600, 100=0,01450, 1000=0,00652, 2500=0,00566 (USD); RoHS: Yes; Case/Package: 0805; Contact Plating: Tin,Matte; Case Code (Imperial): 0805; Case Code (Metric): 2012; Size Code: 0805; Min Operating Temperature: -55°C; Max Operating Temperature: 155°C; Resistor Type: Thick Film; Tolerance: 5%; Packaging: Tape and Reel; Termination: SMD/SMT; Features: Moisture Resistant; Series: RC; Max Power Dissipation: 125mW; Number of Terminations: 2; Resistance Tolerance: 5%; Construction: Rectangular; Length: 2mm; Width: 1.25mm; Height: 0.5mm; Depth: 1.25mm; Radiation Hardening: No; RoHS Compliant: Yes; REACH SVHC: Unknown; Military Standard: Not; Lead Free: Lead Free; ComponentLink1URL: https://datasheet.ciiva.com/7941/444164-7941870.pdf?src-supplier=Element14; ComponentLink1Description: https://datasheet.ciiva.com/7941/444164-7941870.pdf?src-supplier=Element14; ComponentLink2URL: https://datasheet.ciiva.com/7941/444164-7941871.pdf?src-supplier=Element14; ComponentLink2Description: https://datasheet.ciiva.com/7941/444164-7941871.pdf?src-supplier=Element14; ComponentLink3URL: https://datasheet.ciiva.com/7983/444164-7983765.pdf?src-supplier=Element14; ComponentLink3Description: https://datasheet.ciiva.com/7983/444164-7983765.pdf?src-supplier=Element14; Supplier Part Number 1: 311-10KARCT-ND
R38 R90 = AC0805JR-07100KL: Thick Film Resistors - SMD 0805  100K ohm 5% 1/8W; Manufacturer 1: Yageo; Power Rating: 125mW; Voltage Rating: 150V; Temperature Coefficient: 100ppm/°C; Supplier 1: Digi-Key; Manufacturer Part Number 1: AC0805JR-07100KL; Stock 1: 23; Pricing 1: 1=0,10000, 10=0,04300, 100=0,01730, 1000=0,00777, 2500=0,00674 (USD); RoHS: Yes; Case/Package: 0805; Case Code (Imperial): 0805; Case Code (Metric): 2012; Weight: 0.000194oz; Min Operating Temperature: -55°C; Max Operating Temperature: 155°C; Tolerance: 5%; Packaging: Tape and Reel; Resistor Type: Thick Film; Number of Terminations: 2; Termination: SMD/SMT; Max Power Dissipation: 125mW; Features: Moisture Resistant,Automotive AEC-Q200; Series: AC; Length: 0.079inch; Width: 0.049inch; Height: 0.024inch; RoHS Compliant: Yes; ComponentLink1URL: https://datasheet.ciiva.com/12576/pyu-ac-51-rohs-l-2-12576604.pdf?src-supplier=Mouser; ComponentLink1Description: https://datasheet.ciiva.com/12576/pyu-ac-51-rohs-l-2-12576604.pdf?src-supplier=Mouser; Supplier Part Number 1: YAG3756CT-ND
U1 U13 = TLV2472CDR: IC OPAMP GP 2.8MHZ RRO 8SOIC; Manufacturer 1: Texas Instruments; Min Dual Supply Voltage: 1.35V; Max Dual Supply Voltage: 3V; Nominal Supply Current: 1.8mA; Voltage Gain: 120dB; Common Mode Rejection Ratio: 61dB; Number of Channels: 2; Slew Rate: 1.4V/µs; Max I/O Voltage: 2.2mV; Input Bias Current: 50pA; Operating Supply Current: 600uA; Output Current per Channel: 35mA; Max Supply Voltage: 6V; Min Supply Voltage: 2.7V; Power Dissipation: 710mW; Amplifier Type: GENERAL PURPOSE; Supplier 1: Digi-Key; Stock 1: 5061; Pricing 1: 1=2,73000, 10=2,45200, 25=2,31360, 100=1,97110, 250=1,85076, 500=1,61942, 1000=1,52775 (USD); RoHS: Yes; Case/Package: D; Number of Pins: 8; Min Operating Temperature: -40°C; Max Operating Temperature: 125°C; Packaging: Tape and Reel; Unity Gain Bandwidth Product: 2.8MHz; Package Quantity: 2500; Operating Supply Voltage: 3V; Input Offset Voltage (Vos): 2.2mV; Gain Bandwidth Product: 2.8MHz; Number of Circuits: 2; Number of Elements: 2; Bandwidth: 2.8MHz; Output Current: 35mA; Supply Current: 1.8mA; Technology: CMOS; Radiation Hardening: No; Lead Free: Lead Free; RoHS Compliant: Yes; ComponentLink1URL: https://datasheet.ciiva.com/14461/tlv2475a-14461901.pdf?src-supplier=Avnet; ComponentLink1Description: https://datasheet.ciiva.com/14461/tlv2475a-14461901.pdf?src-supplier=Avnet; ComponentLink2URL: https://datasheet.ciiva.com/1798/tlv2470a-1798989.pdf?src-supplier=Digi-Key; ComponentLink2Description: https://datasheet.ciiva.com/1798/tlv2470a-1798989.pdf?src-supplier=Digi-Key; ComponentLink3URL: https://datasheet.ciiva.com/1798/tlv2470a-1798990.pdf?src-supplier=Digi-Key; ComponentLink3Description: https://datasheet.ciiva.com/1798/tlv2470a-1798990.pdf?src-supplier=Digi-Key; ComponentLink4URL: https://datasheet.ciiva.com/1798/tlv2470a-1798991.pdf?src-supplier=Digi-Key; ComponentLink4Description: https://datasheet.ciiva.com/1798/tlv2470a-1798991.pdf?src-supplier=Digi-Key; ComponentLink5URL: https://datasheet.ciiva.com/26226/tlv2475a-26226351.pdf?src-supplier=Avnet+Europe; ComponentLink5Description: https://datasheet.ciiva.com/26226/tlv2475a-26226351.pdf?src-supplier=Avnet+Europe; ComponentLink6URL: https://datasheet.ciiva.com/48711/001071769-da-01-en-ic-opamp-gp-r-r-2-tlv2472cdr-soic-8-tid-48711766.pdf?src-supplier=Conrad; ComponentLink6Description: https://datasheet.ciiva.com/48711/001071769-da-01-en-ic-opamp-gp-r-r-2-tlv2472cdr-soic-8-tid-48711766.pdf?src-supplier=Conrad; Supplier Part Number 1: 296-2440-1-ND